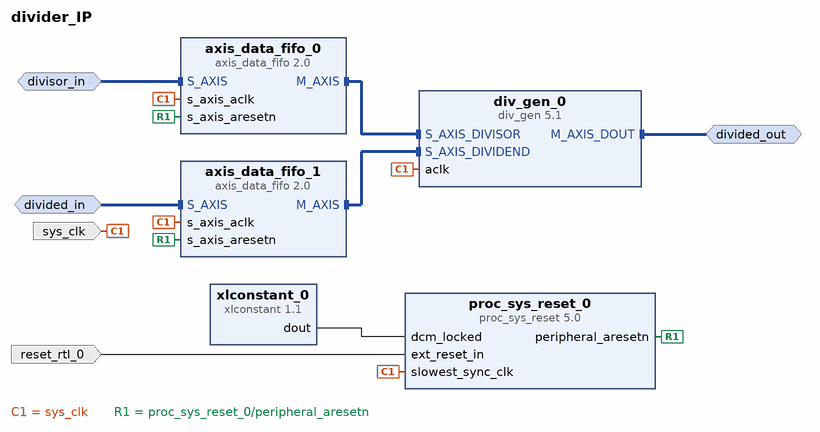
[diagram p0: block diagram of the top level]
# Vivado block design divider_IP, xc7z020clg400-1, Vivado 2020.2
create_bd_design divider_IP

create_bd_intf_port -mode Slave -vlnv xilinx.com:interface:axis_rtl:1.0 divisor_in
set_property -dict [list \
  CONFIG.HAS_TKEEP 0 \
  CONFIG.HAS_TLAST 0 \
  CONFIG.HAS_TREADY 1 \
  CONFIG.HAS_TSTRB 0 \
  CONFIG.LAYERED_METADATA undef \
  CONFIG.TDATA_NUM_BYTES 2 \
  CONFIG.TDEST_WIDTH 0 \
  CONFIG.TID_WIDTH 0 \
  CONFIG.TUSER_WIDTH 0 \
] [get_bd_intf_ports divisor_in]
create_bd_intf_port -mode Slave -vlnv xilinx.com:interface:axis_rtl:1.0 divided_in
set_property -dict [list \
  CONFIG.HAS_TKEEP 0 \
  CONFIG.HAS_TLAST 0 \
  CONFIG.HAS_TREADY 1 \
  CONFIG.HAS_TSTRB 0 \
  CONFIG.LAYERED_METADATA undef \
  CONFIG.TDATA_NUM_BYTES 2 \
  CONFIG.TDEST_WIDTH 0 \
  CONFIG.TID_WIDTH 0 \
  CONFIG.TUSER_WIDTH 0 \
] [get_bd_intf_ports divided_in]
create_bd_intf_port -mode Master -vlnv xilinx.com:interface:axis_rtl:1.0 divided_out
create_bd_port -dir I -type clk sys_clk
set_property -dict {CONFIG.FREQ_HZ 100000000} [get_bd_ports sys_clk]
create_bd_port -dir I -type rst reset_rtl_0
set_property -dict {CONFIG.POLARITY ACTIVE_LOW} [get_bd_ports reset_rtl_0]

create_bd_cell -type ip -vlnv xilinx.com:ip:div_gen:5.1 div_gen_0
create_bd_cell -type ip -vlnv xilinx.com:ip:axis_data_fifo:2.0 axis_data_fifo_0
set_property -dict {CONFIG.FIFO_DEPTH 16 CONFIG.TDATA_NUM_BYTES 2} [get_bd_cells axis_data_fifo_0]
create_bd_cell -type ip -vlnv xilinx.com:ip:axis_data_fifo:2.0 axis_data_fifo_1
set_property -dict {CONFIG.TDATA_NUM_BYTES 2} [get_bd_cells axis_data_fifo_1]
create_bd_cell -type ip -vlnv xilinx.com:ip:proc_sys_reset:5.0 proc_sys_reset_0
create_bd_cell -type ip -vlnv xilinx.com:ip:xlconstant:1.1 xlconstant_0

# ---- connections ----

connect_bd_intf_net [get_bd_intf_ports divided_out] [get_bd_intf_pins div_gen_0/M_AXIS_DOUT]
connect_bd_intf_net [get_bd_intf_pins axis_data_fifo_1/M_AXIS] [get_bd_intf_pins div_gen_0/S_AXIS_DIVIDEND]
connect_bd_intf_net [get_bd_intf_ports divided_in] [get_bd_intf_pins axis_data_fifo_1/S_AXIS]
connect_bd_intf_net [get_bd_intf_pins axis_data_fifo_0/M_AXIS] [get_bd_intf_pins div_gen_0/S_AXIS_DIVISOR]
connect_bd_intf_net [get_bd_intf_ports divisor_in] [get_bd_intf_pins axis_data_fifo_0/S_AXIS]
connect_bd_net [get_bd_ports sys_clk] \
  [get_bd_pins proc_sys_reset_0/slowest_sync_clk] [get_bd_pins axis_data_fifo_1/s_axis_aclk] \
  [get_bd_pins axis_data_fifo_0/s_axis_aclk] [get_bd_pins div_gen_0/aclk]
connect_bd_net [get_bd_pins proc_sys_reset_0/peripheral_aresetn] \
  [get_bd_pins axis_data_fifo_1/s_axis_aresetn] [get_bd_pins axis_data_fifo_0/s_axis_aresetn]
connect_bd_net -net reset_rtl_0_1 [get_bd_ports reset_rtl_0] [get_bd_pins proc_sys_reset_0/ext_reset_in]
connect_bd_net [get_bd_pins xlconstant_0/dout] [get_bd_pins proc_sys_reset_0/dcm_locked]

validate_bd_design
save_bd_design
